# EAGLE design TSMP-TS (EAGLE 9.4.0)
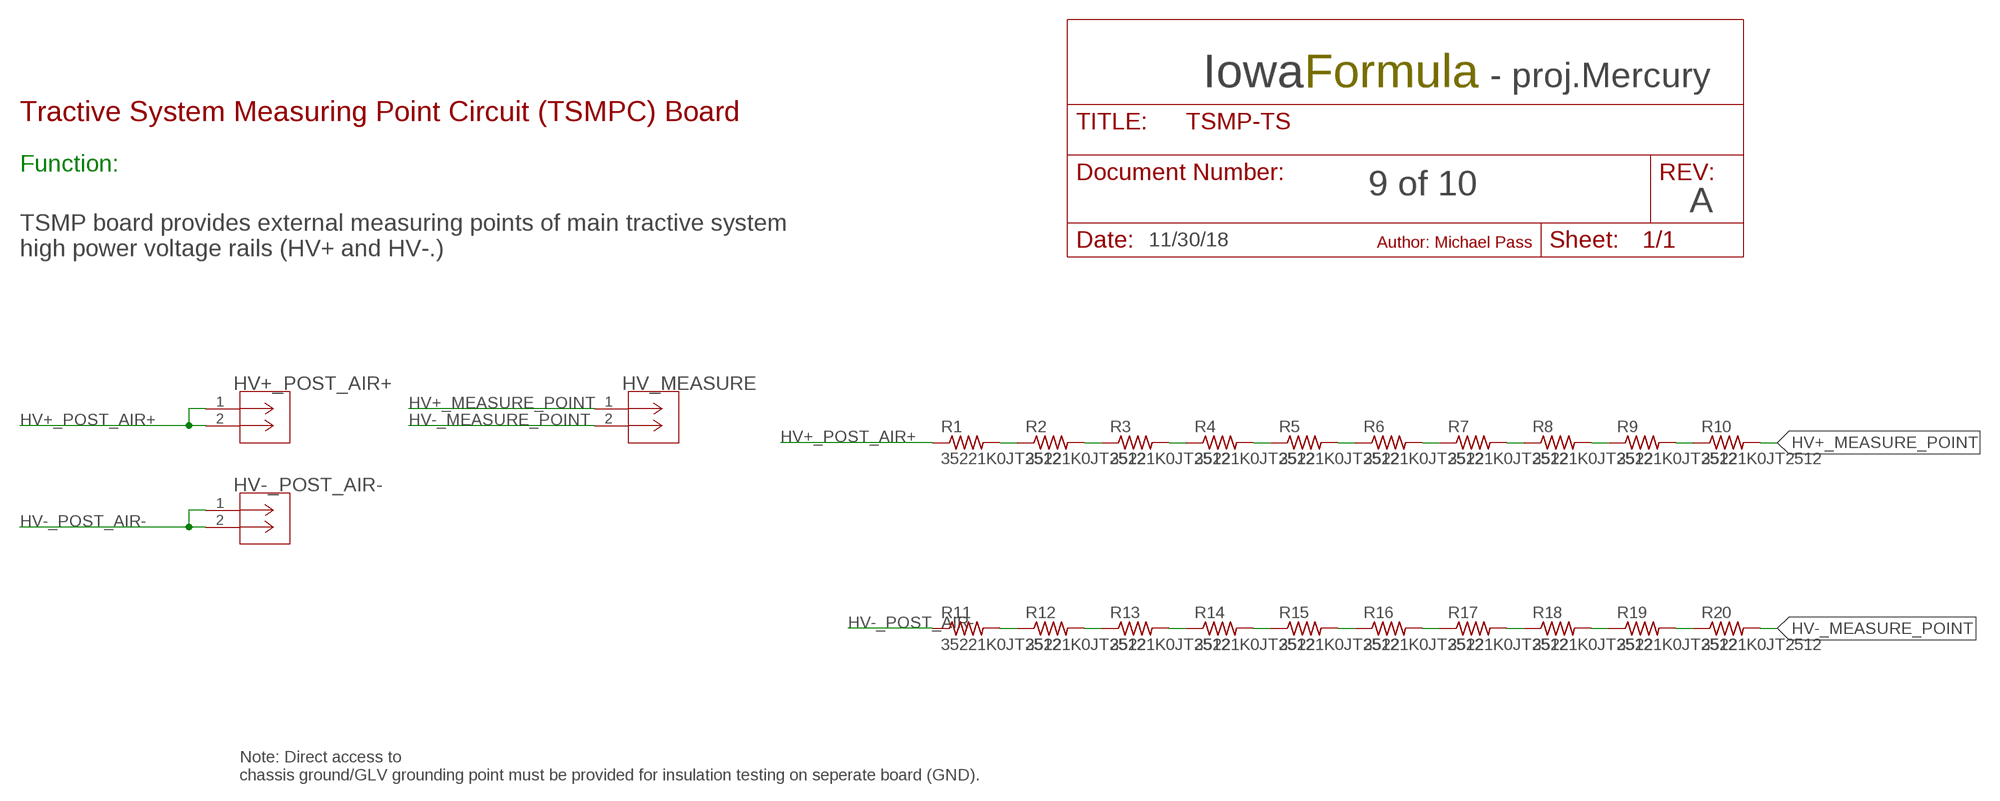
[diagram p0: schematic, sheet 1]

## Parts
HV+_POST_AIR+  2P_1-770166-0  [CON2_1X2_P163_VMNL-1MTG]
HV-_POST_AIR-  2P_1-770166-0  [CON2_1X2_P163_VMNL-1MTG]
HV_MEASURE  2P_1-770166-0  [CON2_1X2_P163_VMNL-1MTG]
R1  35221K0JT2512  [R2512]
R2  35221K0JT2512  [R2512]
R3  35221K0JT2512  [R2512]
R4  35221K0JT2512  [R2512]
R5  35221K0JT2512  [R2512]
R6  35221K0JT2512  [R2512]
R7  35221K0JT2512  [R2512]
R8  35221K0JT2512  [R2512]
R9  35221K0JT2512  [R2512]
R10  35221K0JT2512  [R2512]
R11  35221K0JT2512  [R2512]
R12  35221K0JT2512  [R2512]
R13  35221K0JT2512  [R2512]
R14  35221K0JT2512  [R2512]
R15  35221K0JT2512  [R2512]
R16  35221K0JT2512  [R2512]
R17  35221K0JT2512  [R2512]
R18  35221K0JT2512  [R2512]
R19  35221K0JT2512  [R2512]
R20  35221K0JT2512  [R2512]

## Nets
HV+_MEASURE_POINT: HV_MEASURE.1 R10.2
HV+_POST_AIR+: HV+_POST_AIR+.1 HV+_POST_AIR+.2 R1.1
HV-_MEASURE_POINT: HV_MEASURE.2 R20.2
HV-_POST_AIR-: HV-_POST_AIR-.1 HV-_POST_AIR-.2 R11.1
N$1: R1.2 R2.1
N$2: R2.2 R3.1
N$3: R3.2 R4.1
N$4: R4.2 R5.1
N$5: R5.2 R6.1
N$6: R6.2 R7.1
N$7: R7.2 R8.1
N$8: R8.2 R9.1
N$9: R9.2 R10.1
N$21: R11.2 R12.1
N$22: R12.2 R13.1
N$23: R13.2 R14.1
N$24: R14.2 R15.1
N$25: R15.2 R16.1
N$26: R16.2 R17.1
N$27: R17.2 R18.1
N$28: R18.2 R19.1
N$29: R19.2 R20.1

## Notes on the sheet
- Iowa | Formula | - proj.Mercury
- Tractive System Measuring Point Circuit (TSMPC) Board
- Function:
- 9 of 10
- A
- 11/30/18 | Author: Michael Pass
- TSMP board provides external measuring points of main tractive system
  high power voltage rails (HV+ and HV-.)
- Note: Direct access to
  chassis ground/GLV grounding point must be provided for insulation testing on seperate board (GND).

## Library data of the parts
HV+_POST_AIR+ HV-_POST_AIR- HV_MEASURE = con-MATE-N-LOK:2P_1-770166-0; MANUFACTURER_PART_NUMBER: 17701660; VENDOR: TE Connectivity
R1-R20 = IowaFormula:35221K0JT

## Board
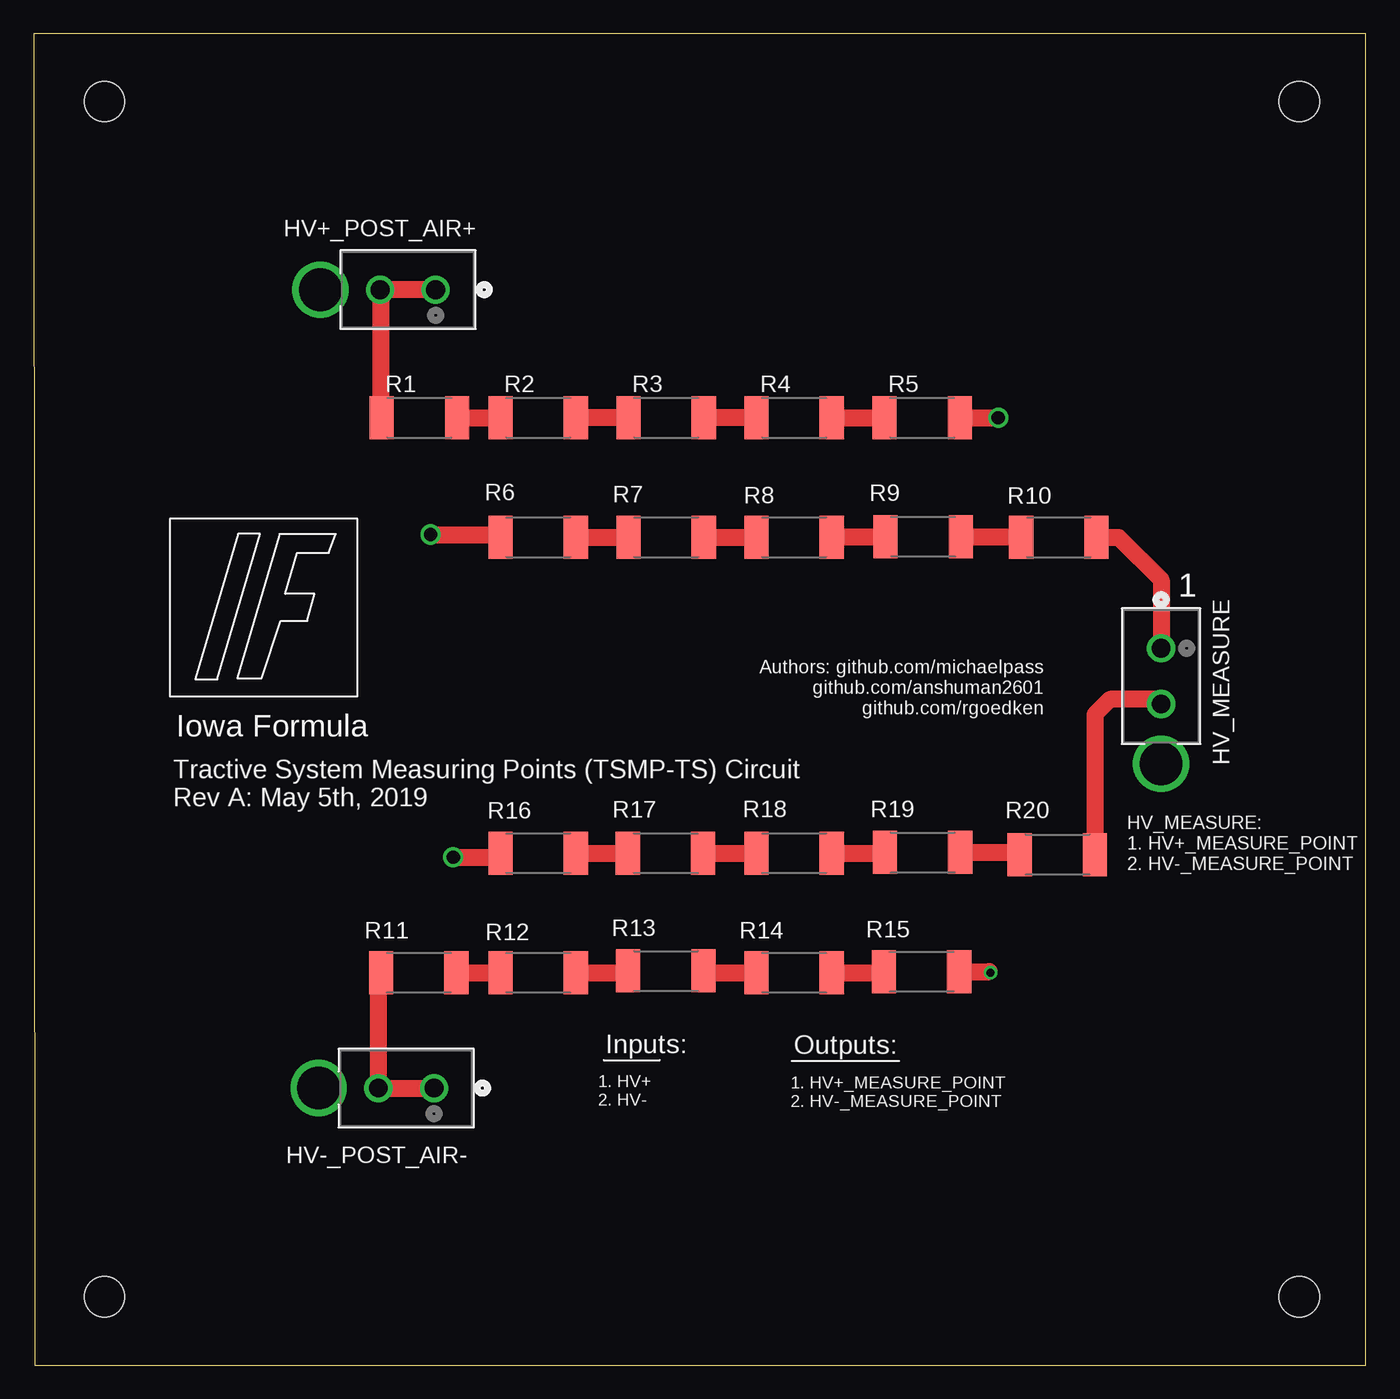
[diagram p1: board, top side]
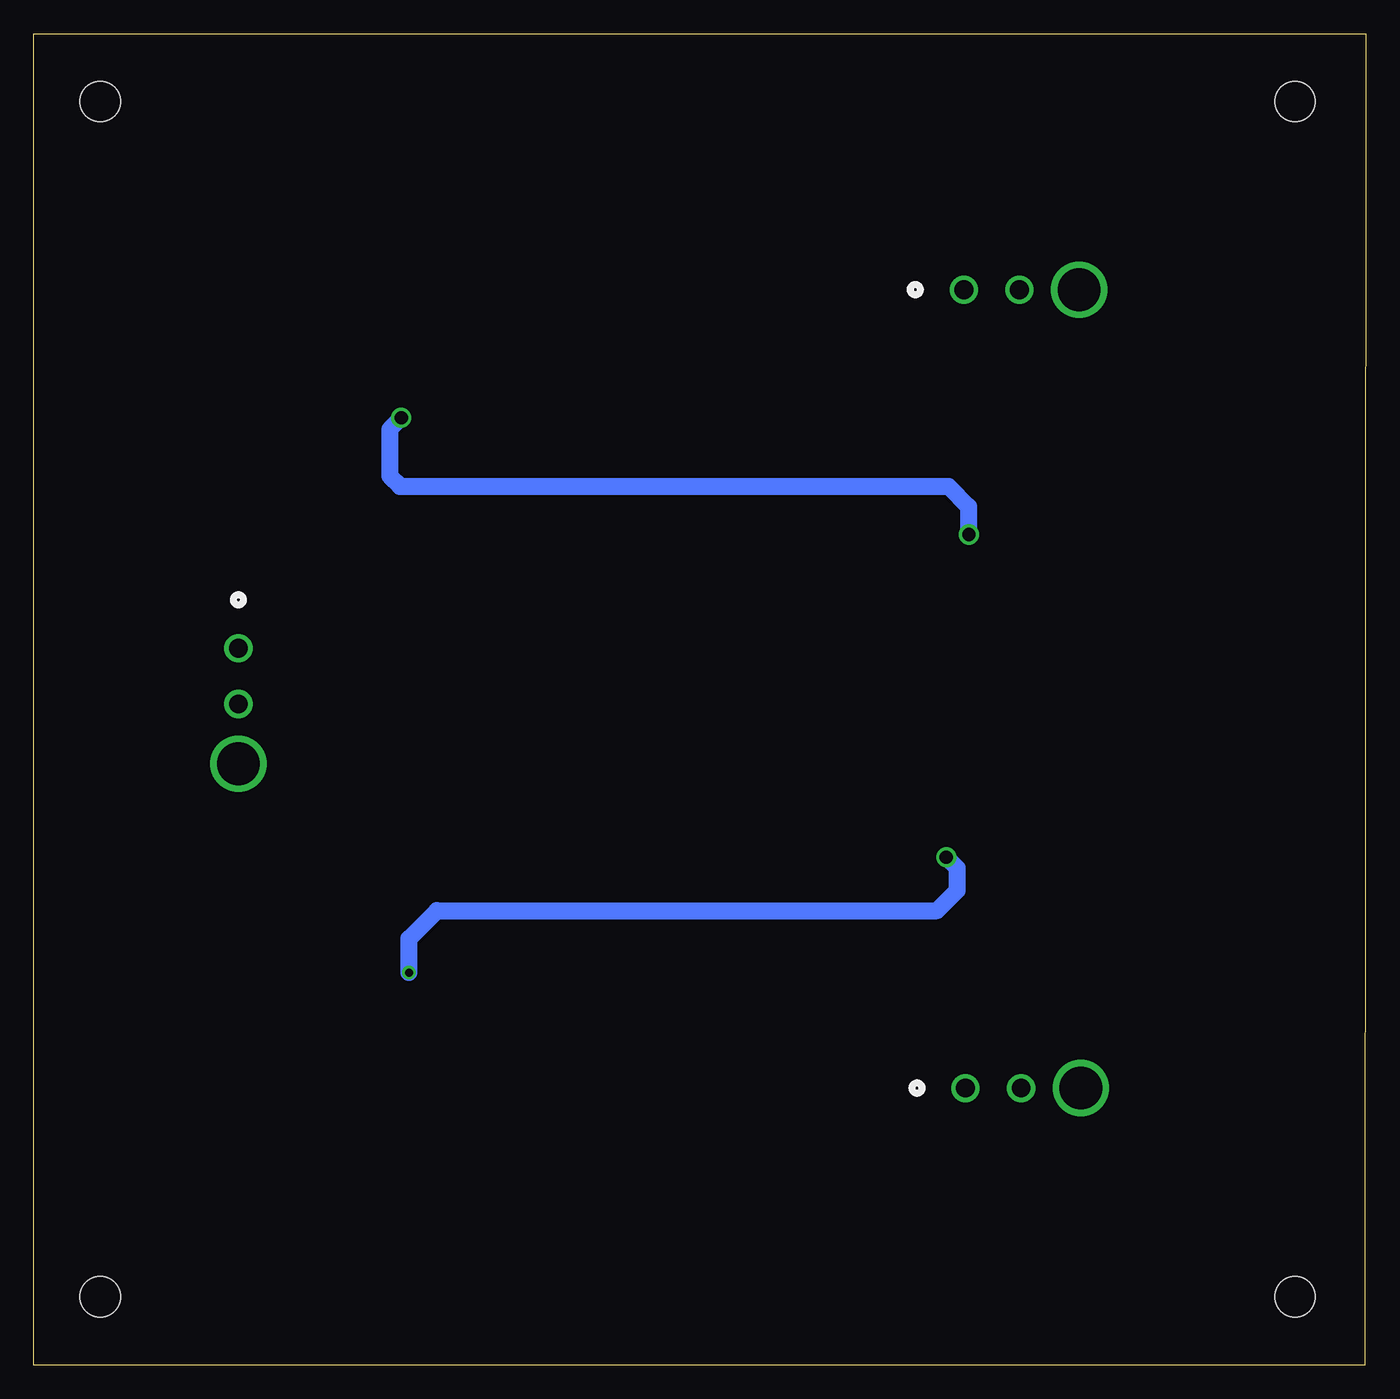
[diagram p2: board, bottom side, seen from below]

Size 99.14 x 99.06 mm. Coordinates in mm from the lower left corner, seen from the top.
Outline: 0.08,0 99.14,0 99.14,99.06 0,99.06 0.08,0
Copper layers (1*16): Top 0.035mm / dielectric 1.5mm / Bottom 0.035mm
Design rules "default": minimum track width 6mil, minimum drill 0.35mm, track to track 6mil, track to pad 6mil, pad to pad 6mil, via to via 6mil, smd to smd 6mil, copper to edge 40mil, drill to drill 6mil, minimum pad ring 10mil, minimum via ring 8mil, stop-mask expansion 4mil, vias tented up to drill 0mil, thermal gap 10mil
Holes 3 mm at 5.28,94.01 94.18,94.01 5.28,5.11 94.18,5.11

### Footprints (pad centres in the part's own frame; a part is rotated, then mirrored left to right if it is on the bottom)
CON2_1X2_P163_VMNL-1MTG = drill 1.397 pad 1.905: 1 0,0; 2 4.14,0 | drill 3.175 pad 3.175: 3 8.585,0
R2512 = smd 1.8 x 3.2: 1 -2.8,0; 2 2.8,0

### Placement (x,y rotation side)
HV+_POST_AIR+  29.92,80.01 180 top
HV-_POST_AIR-  29.79,20.62 180 top
HV_MEASURE  83.9,53.34 270 top
R1  28.7,70.48 0 top
R2  37.54,70.48 0 top
R3  47.07,70.48 0 top
R4  56.59,70.48 0 top
R5  66.12,70.48 0 top
R6  37.54,61.59 0 top
R7  47.07,61.59 0 top
R8  56.59,61.59 0 top
R9  66.19,61.65 0 top
R10  76.28,61.59 0 top
R11  28.65,29.21 0 top
R12  37.54,29.21 0 top
R13  47.04,29.34 0 top
R14  56.59,29.21 0 top
R15  66.07,29.29 0 top
R16  37.54,38.1 0 top
R17  47.02,38.1 0 top
R18  56.59,38.1 0 top
R19  66.14,38.15 0 top
R20  76.17,38 0 top

### Tracks (layer width: path | path; a pad name or v marks a point on that pad's centre or on a via)
HV+_MEASURE_POINT
  Top 1.27: R10.2 80.72,61.59 83.9,58.42 HV_MEASURE.1
HV+_POST_AIR+
  Top 0.813: 25.81,70.58 R1.1
  Top 1.27: HV+_POST_AIR+.1 HV+_POST_AIR+.2 25.81,79.98 25.81,70.58
HV-_MEASURE_POINT
  Top 1.27: HV_MEASURE.2 83.57,49.53 80.09,49.53 78.97,48.42 R20.2
HV-_POST_AIR-
  Top 1.27: HV-_POST_AIR-.1 HV-_POST_AIR-.2 25.65,29.01 R11.1
N$1
  Top 1.27: R1.2 R2.1
N$2
  Top 1.27: R3.1 R2.2
N$3
  Top 1.27: R4.1 R3.2
N$4
  Top 1.27: R4.2 R5.1
N$5  (via drill 1)
  Top 0.813: 34.54,61.8 R6.1
  Top 1.27: R5.2 v71.78,70.48 | v29.54,61.8 34.54,61.8
  Bottom 0.813: 29.56,61.82 v29.54,61.8
  Bottom 1.27: v71.78,70.48 72.64,69.62 72.64,66.14 71.88,65.38 31.06,65.38 29.56,63.88 29.56,61.82
N$6
  Top 1.27: R6.2 R7.1
N$7
  Top 1.27: R7.2 R8.1
N$8
  Top 0.813: R8.2 59.44,61.65
  Top 1.27: 59.44,61.65 R9.1
N$9
  Top 0.813: 73.43,61.65 R10.1
  Top 1.27: R9.2 73.43,61.65
N$21
  Top 1.27: R11.2 R12.1
N$22
  Top 0.813: 44.11,29.21 R13.1
  Top 1.27: R12.2 44.11,29.21
N$23
  Top 0.813: R13.2 49.97,29.21
  Top 1.27: 49.97,29.21 R14.1
N$24
  Top 0.813: 63.19,29.21 R15.1
  Top 1.27: R14.2 63.19,29.21
N$25  (via drill 0.6, 1)
  Top 0.813: 71.12,29.29 v71.2,29.21 | 34.44,37.8 R16.1
  Top 1.27: R15.2 71.12,29.29 | v31.22,37.8 34.44,37.8
  Bottom 1.27: v71.2,29.21 71.2,31.75 69.11,33.83 31.9,33.83 30.4,35.33 30.4,36.98 v31.22,37.8
N$26
  Top 1.27: R16.2 R17.1
N$27
  Top 1.27: R17.2 R18.1
N$28
  Top 0.813: 63.29,38.1 R19.1
  Top 1.27: R18.2 63.29,38.1
N$29
  Top 0.813: 73.22,38.15 R20.1
  Top 1.27: R19.2 73.22,38.15

### Text on the board
tNames: 1 | Authors: github.com/michaelpass / github.com/anshuman2601 / github.com/rgoedken | Iowa Formula | Tractive System Measuring Points (TSMP-TS) Circuit / Rev A: May 5th, 2019 | HV_MEASURE: / 1. HV+_MEASURE_POINT / 2. HV-_MEASURE_POINT | Inputs: | Outputs: | 1. HV+ / 2. HV- | 1. HV+_MEASURE_POINT / 2. HV-_MEASURE_POINT